# EasyEDA Pro project ProProject_Driver_STM32F405_2023-10-07.epro, schematic Schematic1_1

## Sheets
1 P1: Create Date: 2023-02-15; Page Name: P1; Project Name: Driver_STM32F405; Schematic Name: Schematic1_1; Update Date: 2023-04-14; Company: 嘉立创EDA; Page Size: A4; Version: V1.0
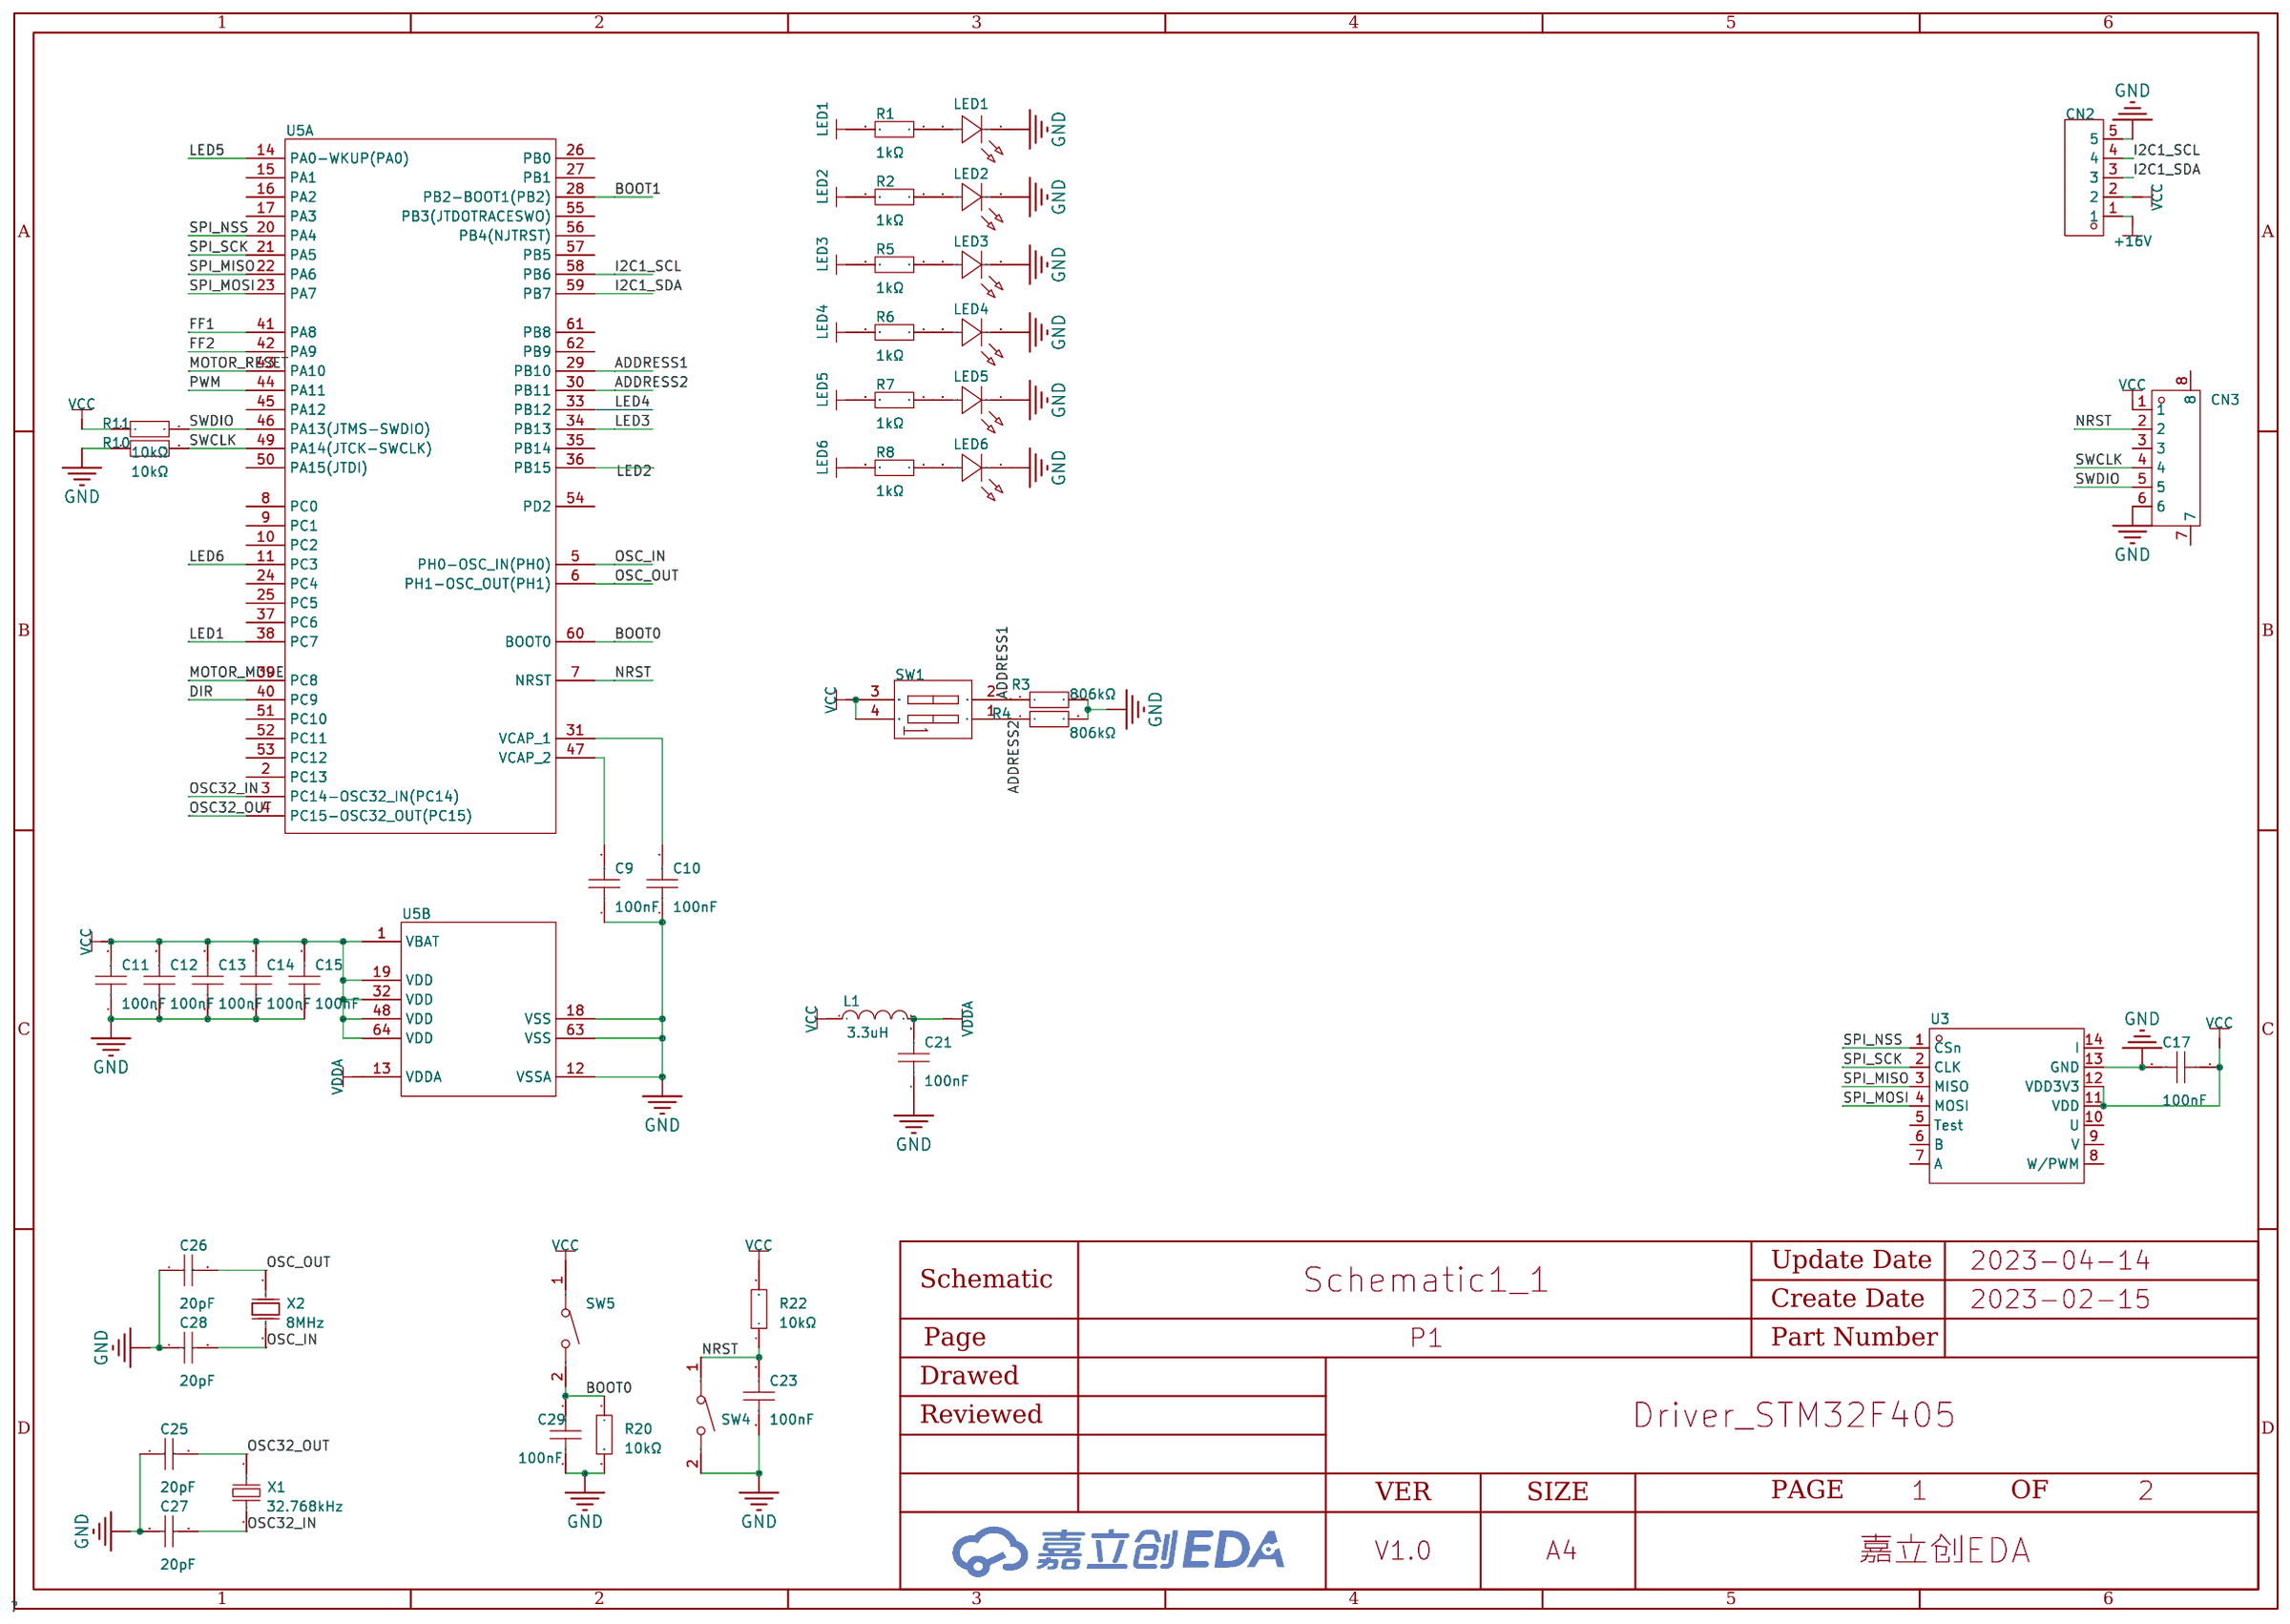
[diagram p2: P1]
2 P2: Create Date: 2023-04-06; Page Name: P2; Update Date: 2023-04-13
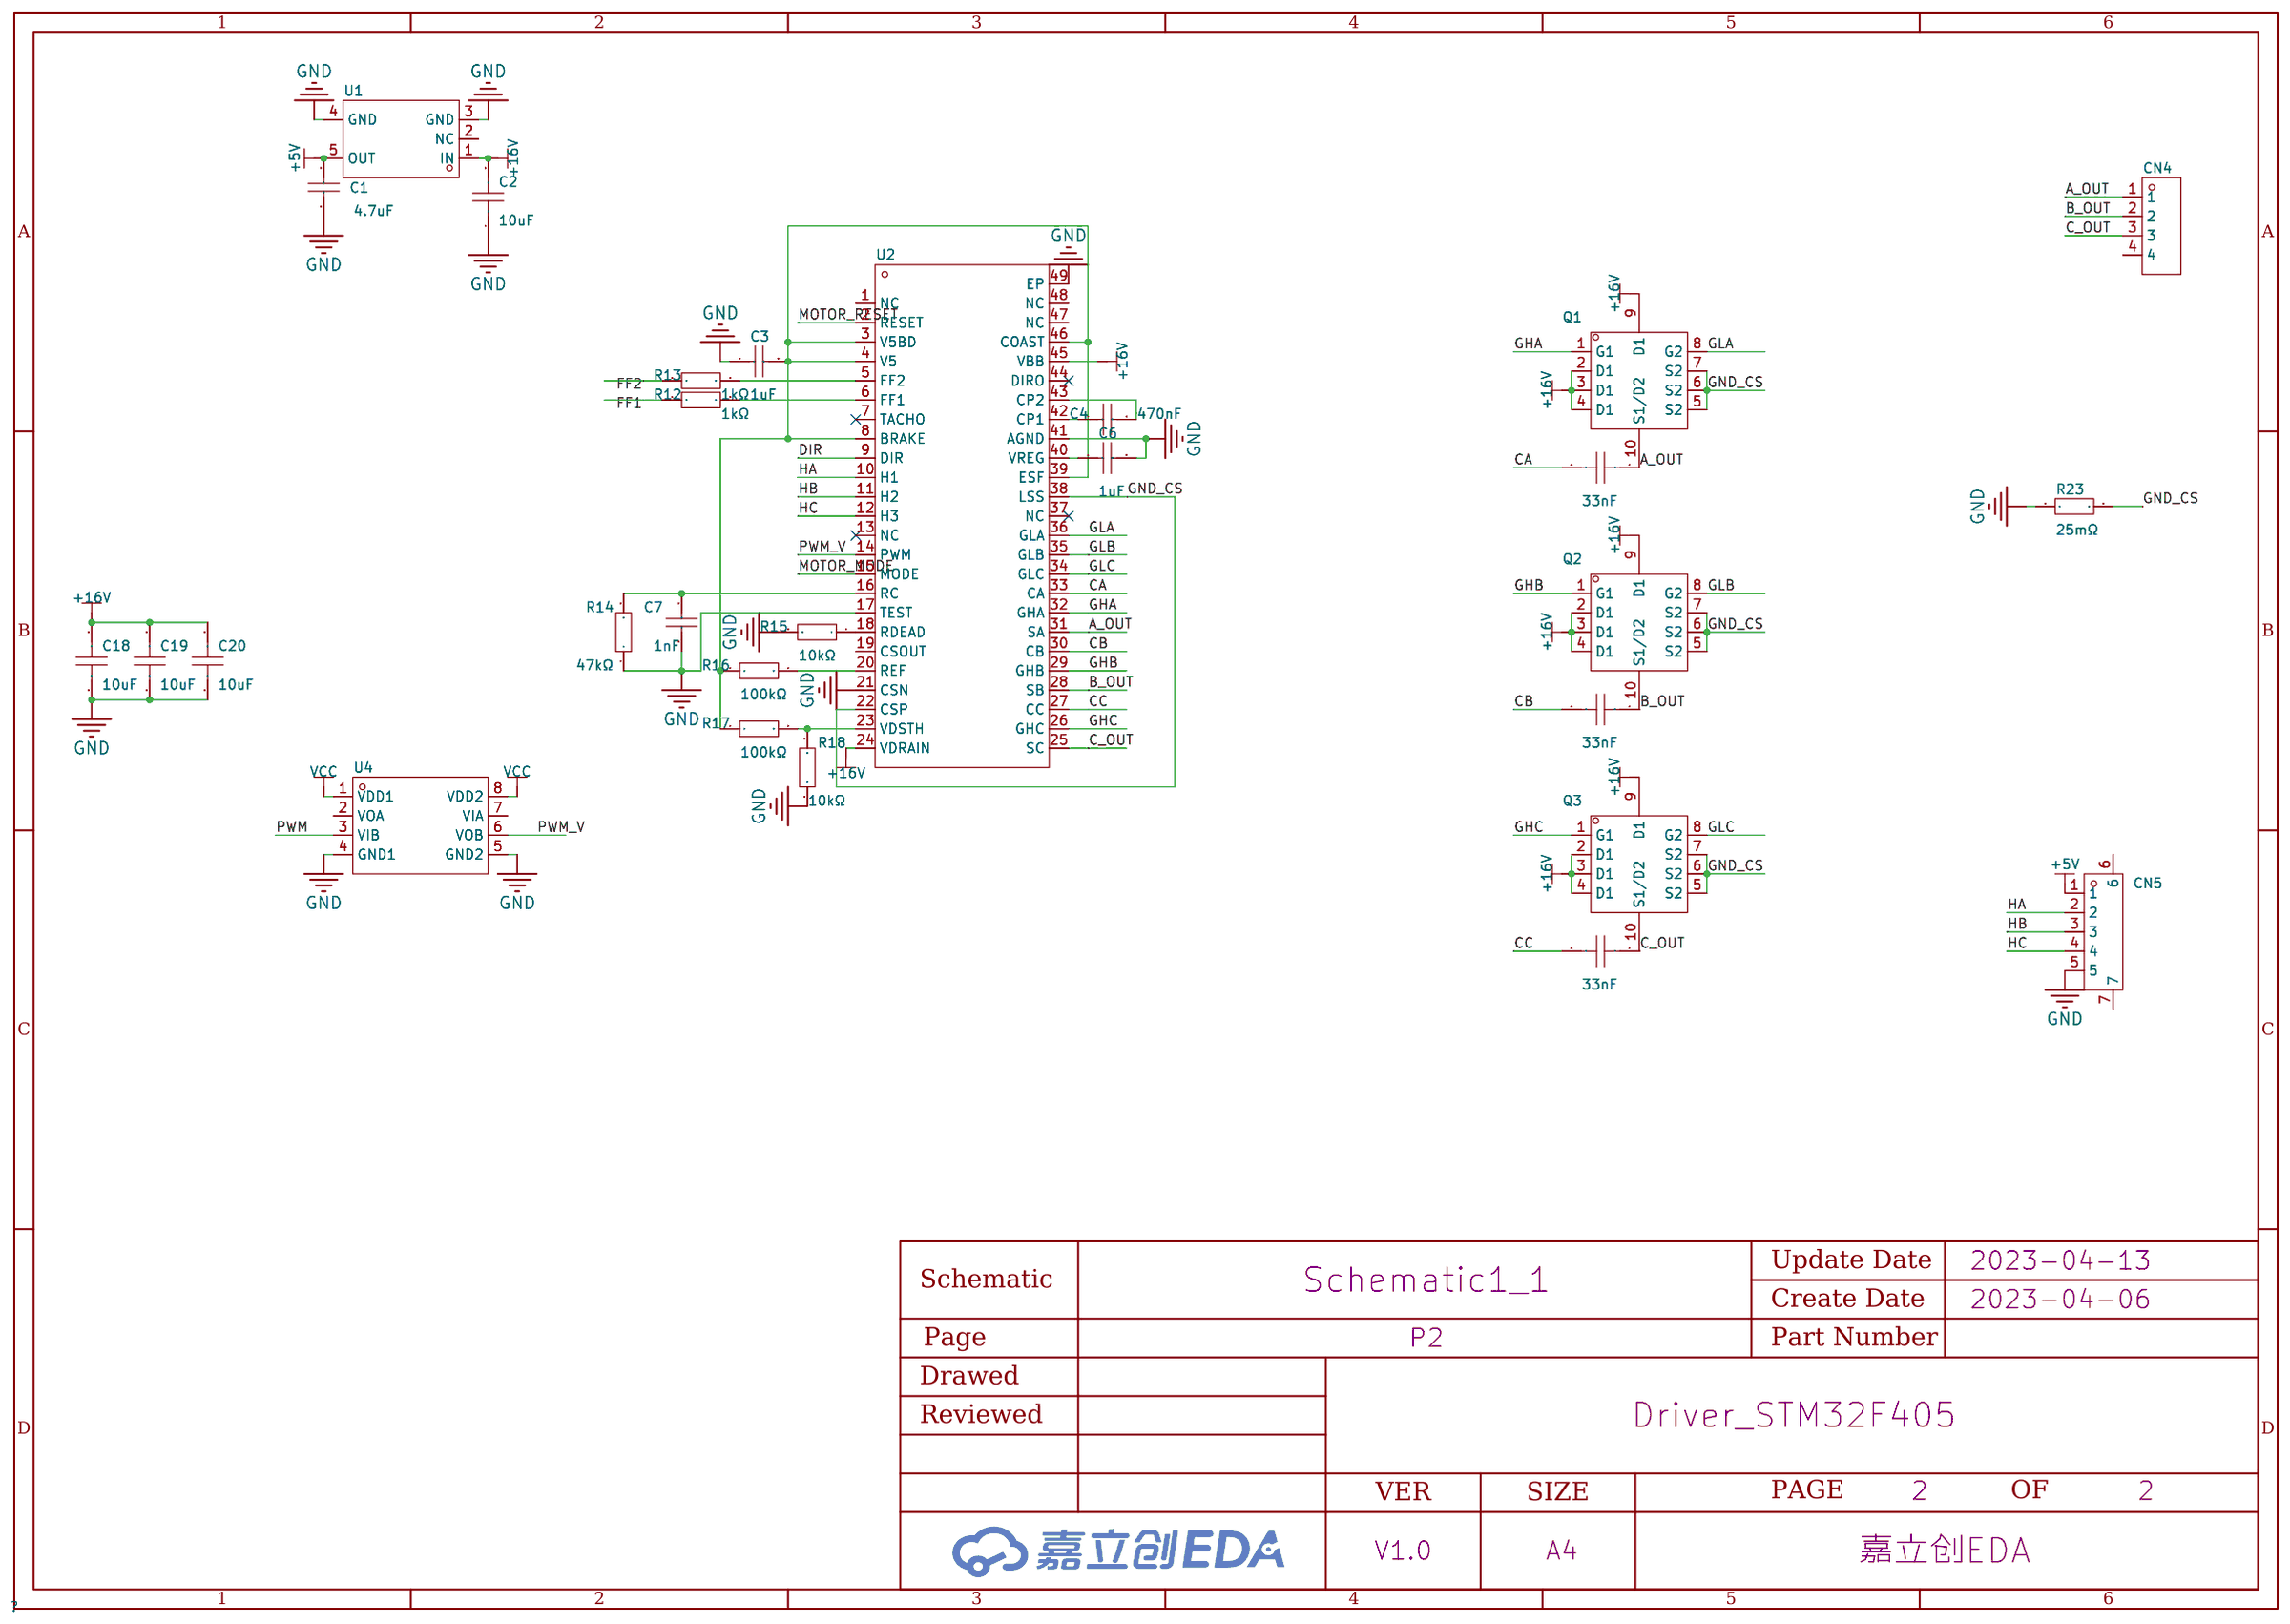
[diagram p3: P2]

## Parts
sheet P1
C9  100nF  [C0603]
C10  100nF  [C0603]
C11  100nF  [C0603]
C12  100nF  [C0603]
C13  100nF  [C0603]
C14  100nF  [C0603]
C15  100nF  [C0603]
C17  100nF  [C0603]
C21  100nF  [C0603]
C23  100nF  [C0603]
C25  20pF  [C0603]
C26  20pF  [C0603]
C27  20pF  [C0603]
C28  20pF  [C0603]
C29  100nF  [C0603]
CN2  5264-5AWD米色  [CONN-TH_5P-P2.50_5264-5AWD]
CN3  532610671  [CONN-SMD_6P-P1.25_53261-0671]
L1  3.3uH  [L0603]
LED1  XL-1608SURC-06  [LED0603-RD_RED]
LED2  XL-1608SYGC-06  [LED0603-RD_GREEN]
LED3  XL-1608SYGC-06  [LED0603-RD_GREEN]
LED4  XL-1608SYGC-06  [LED0603-RD_GREEN]
LED5  XL-1608UBC-04  [LED0603-RD_BLUE]
LED6  XL-1608UBC-04  [LED0603-RD_BLUE]
R1  1kΩ  [R0603]
R2  1kΩ  [R0603]
R3  806kΩ  [R0603]
R4  806kΩ  [R0603]
R5  1kΩ  [R0603]
R6  1kΩ  [R0603]
R7  1kΩ  [R0603]
R8  1kΩ  [R0603]
R10  10kΩ  [R0603]
R11  10kΩ  [R0603]
R20  10kΩ  [R0603]
R22  10kΩ  [R0603]
SW1  DSHP02TSGER  [SW-SMD_DSHP02TSGER]
SW4  TS-1088-AR02016  [SW-SMD_L3.9-W3.0-P4.45]
SW5  TS-1088-AR02016  [SW-SMD_L3.9-W3.0-P4.45]
U3  AS5047P-ATSM  [TSSOP-14_L5.0-W4.4-P0.65-LS6.4-BL]
U5  STM32F405RGT6  [LQFP-64_L10.0-W10.0-P0.50-LS12.0-BL]  (sections 1,2)
X1  32.768kHz  [FC-135R_L3.2-W1.5]
X2  8MHz  [CRYSTAL-SMD_L5.0-W3.2]
sheet P2
C1  4.7uF  [C0603]
C2  10uF  [C0603]
C3  1uF  [C0603]
C4  470nF  [C0603]
C5  33nF  [C0603]
C6  1uF  [C0603]
C7  1nF  [C0603]
C8  33nF  [C0603]
C16  33nF  [C0603]
C18  10uF  [C1206]
C19  10uF  [C1206]
C20  10uF  [C1206]
CN4  X2011WR-04A-N0SN  [CONN-TH_X2011WR-04A-N0SN]
CN5  X1002WRS-05L-HF-LPSW  [CONN-SMD_X1002WRS-05L-HF-LPSN]
Q1  TDM3412  [DFN3X3E-8_L3.0-W3.0-P0.65-BL-EP2]
Q2  TDM3412  [DFN3X3E-8_L3.0-W3.0-P0.65-BL-EP2]
Q3  TDM3412  [DFN3X3E-8_L3.0-W3.0-P0.65-BL-EP2]
R12  1kΩ  [R0603]
R13  1kΩ  [R0603]
R14  47kΩ  [R0603]
R15  10kΩ  [R0603]
R16  100kΩ  [R0603]
R17  100kΩ  [R0603]
R18  10kΩ  [R0603]
R23  25mΩ  [R1206]
U1  TPS7B6950DBVR  [SOT-23-5_L3.0-W1.7-P0.95-LS2.8-BL]
U2  A3930KJPTR-T  [LQFP-48_L7.0-W7.0-P0.50-LS9.0-BL-EP]
U4  π122U31  [SOIC-8_L4.9-W3.9-P1.27-LS6.0-BL]

## Library data of the parts
C9-C15 C17 C21 C23 C29 = TCC0603X7R104K500CT: 容值:100nF;精度:±10%;额定电压:50V;材质(温度系数):X7R;; LCSC Part Name: 100nF ±10% 50V; Supplier Part: C282519; Manufacturer: CCTC(三环); Supplier Footprint: 0603; JLCPCB Part Class: Extended Part; Datasheet: https://atta.szlcsc.com/upload/public/pdf/source/20180917/C282519_8CE721FA29EE85BB321020B63D7877A0.pdf; Supplier: LCSC; Tolerance: ±10%; Voltage Rated: 50V; Temperature Coefficient: X7R
C25-C28 = CL10C200JB8NNNC: 容值:20pF;精度:±5%;额定电压:50V;材质(温度系数):C0G;; LCSC Part Name: 20pF ±5% 50V; Supplier Part: C1648; Manufacturer: SAMSUNG(三星); Supplier Footprint: 0603; JLCPCB Part Class: Basic Part; Datasheet: https://atta.szlcsc.com/upload/public/pdf/source/20160103/1457707686863.pdf; Supplier: LCSC; Tolerance: ±5%; Voltage Rated: 50V; Temperature Coefficient: C0G
CN2 = 5264-5AWD米色: 参考系列:-;间距:2.5mm;插针结构:1x5P;排数:1;每排PIN数:5;行距:-;安装方式:-;触头材质:磷青铜;; LCSC Part Name: 5264插座 1*5P 弯针 带定位; Supplier Part: C176652; Manufacturer: BOOMELE(博穆精密); Supplier Footprint: 插件,P=2.5mm; JLCPCB Part Class: Extended Part; Datasheet: https://atta.szlcsc.com/upload/public/pdf/source/20180125/C176652_15168701824541304803.pdf; Supplier: LCSC; Pitch: 2.5mm; Pins Structure: 1x5P; Number of Rows: 1; Number of PINs Per Row: 5; Contact Material: 磷青铜
CN3 = 532610671: 参考系列:-;间距:1.25mm;插针结构:1x6P;排数:1;每排PIN数:6;行距:-;安装方式:-;触头材质:青铜;; LCSC Part Name: 1.25mm 1x6P; Supplier Part: C99277; Manufacturer: MOLEX; JLCPCB Part Class: Extended Part; Datasheet: https://atta.szlcsc.com/upload/public/pdf/source/20180713/C99277_7A4A98FEF11A2209B5FFC17F14BF7E54.pdf; Supplier: LCSC; Pitch: 1.25mm; Pins Structure: 1x6P; Number of Rows: 1; Number of PINs Per Row: 6; Contact Material: 青铜
L1 = CMI160808U3R3KT: 额定电流:15mA;电感值:3.3uH;精度:±10%;饱和电流(Isat):-;直流电阻(DCR):1Ω;; LCSC Part Name: 3.3uH ±10% 15mA 1Ω; Supplier Part: C139209; Manufacturer: FH(风华); Supplier Footprint: 0603; JLCPCB Part Class: Extended Part; Datasheet: https://atta.szlcsc.com/upload/public/pdf/source/20180412/C139209_76E8EB9664C870BAE46EFE11DEB22A4C.pdf; Supplier: LCSC; Rated Current: 15mA; Tolerance: ±10%; DC Resistance (DCR): 1Ω
LED1 = XL-1608SURC-06: 发光颜色:红灯;透镜颜色:无色透明;主波长:617nm~621nm;峰值波长:623nm;色温:-;测试电流:25mA;功率:55mW;发光角度:120°;安装方式:正贴;工作温度:-30℃~+85℃;; LCSC Part Name: 红灯 617nm~621nm 正贴; Supplier Part: C965799; Manufacturer: XINGLIGHT(成兴光); Supplier Footprint: 0603; JLCPCB Part Class: Extended Part; Datasheet: https://atta.szlcsc.com/upload/public/pdf/source/20221102/D860AFDD1CDB02C5A8064103A32707E2.pdf; Supplier: LCSC; Emitted Color: 红灯; Lens Color: 无色透明; Dominant Wavelength: 617nm~621nm; Peak Wavelength: 623nm; Forward Current: 25mA; Power Dissipation: 55mW; Viewing Angle: 120°; Mounting Sytle: 正贴; Operating Temperature: -30℃~+85℃
LED2-LED4 = XL-1608SYGC-06: 发光颜色:普绿/黄绿;透镜颜色:无色透明;主波长:570nm~573nm;峰值波长:575nm;色温:2800K~3160K;测试电流:25mA;功率:55mW;发光角度:120°;安装方式:正贴;工作温度:-30℃~+85℃;; LCSC Part Name: 普绿/黄绿 570nm~573nm 2800K~3160K 正贴; Supplier Part: C965805; Manufacturer: XINGLIGHT(成兴光); Supplier Footprint: 0603; JLCPCB Part Class: Extended Part; Datasheet: https://atta.szlcsc.com/upload/public/pdf/source/20221102/F362183196D461585F90F08511E6DE2E.pdf; Supplier: LCSC; Emitted Color: 普绿/黄绿; Lens Color: 无色透明; Dominant Wavelength: 570nm~573nm; Peak Wavelength: 575nm; Color Temperature: 2800K~3160K; Forward Current: 25mA; Power Dissipation: 55mW; Viewing Angle: 120°; Mounting Sytle: 正贴; Operating Temperature: -30℃~+85℃
LED5 LED6 = XL-1608UBC-04: 发光颜色:蓝灯;透镜颜色:无色透明;主波长:460nm~469nm;峰值波长:475nm;色温:-;测试电流:25mA;功率:80mW;发光角度:120°;安装方式:正贴;工作温度:-30℃~+85℃;; LCSC Part Name: 蓝灯 460nm~469nm 正贴; Supplier Part: C965807; Manufacturer: XINGLIGHT(成兴光); Supplier Footprint: 0603; JLCPCB Part Class: Extended Part; Datasheet: https://atta.szlcsc.com/upload/public/pdf/source/20221102/D52C9F3BB075BE608C95388C1716C351.pdf; Supplier: LCSC; Emitted Color: 蓝灯; Lens Color: 无色透明; Dominant Wavelength: 460nm~469nm; Peak Wavelength: 475nm; Forward Current: 25mA; Power Dissipation: 80mW; Viewing Angle: 120°; Mounting Sytle: 正贴; Operating Temperature: -30℃~+85℃
R1 R2 R5-R8 R12 R13 = 0603WAF1001T5E: 电阻类型:厚膜电阻;阻值:1kΩ;精度:±1%;功率:100mW;温度系数:±100ppm/℃;最大工作电压:75V;工作温度范围:-55℃~+155℃;; LCSC Part Name: 1kΩ ±1% 100mW; Supplier Part: C21190; Manufacturer: UNI-ROYAL(厚声); Supplier Footprint: 0603; JLCPCB Part Class: Basic Part; Datasheet: https://atta.szlcsc.com/upload/public/pdf/source/20200306/C422600_1E6D84923E4A46A82E41ADD87F860B5C.pdf; Supplier: LCSC; Type: 厚膜电阻; Tolerance: ±1%; Power(Watts): 100mW; Temperature Coefficient: ±100ppm/℃; Overload Voltage (Max): 75V; Operating Temperature Range: -55℃~+155℃
R3 R4 = 0603WAF8063T5E: 精度:±1%;阻值:806kΩ;温度系数:±100ppm/℃;功率:1/10W;最大工作电压:75V;工作温度范围:-55℃~+155℃;; LCSC Part Name: 806KΩ ±1%; Supplier Part: C23250; Manufacturer: UNI-ROYAL(厚声); Supplier Footprint: 0603; JLCPCB Part Class: Extended Part; Datasheet: https://atta.szlcsc.com/upload/public/pdf/source/20170920/C23250_1505901154958982629.pdf; Supplier: LCSC; Tolerance: ±1%; Temperature Coefficient: ±100ppm/℃; Power(Watts): 1/10W; Overload Voltage (Max): 75V; Operating Temperature Range: -55℃~+155℃
R10 R11 R15 R18 R20 R22 = RC0603FR-0710KL: 电阻类型:厚膜电阻;阻值:10kΩ;精度:±1%;功率:100mW;温度系数:±100ppm/℃;最大工作电压:75V;工作温度范围:-55℃~+155℃;; LCSC Part Name: 10kΩ ±1% 100mW; Supplier Part: C98220; Manufacturer: YAGEO(国巨); Supplier Footprint: 0603; JLCPCB Part Class: Extended Part; Datasheet: https://atta.szlcsc.com/upload/public/pdf/source/20170522/1495423494387.pdf; Supplier: LCSC; Type: 厚膜电阻; Tolerance: ±1%; Power(Watts): 100mW; Temperature Coefficient: ±100ppm/℃; Overload Voltage (Max): 75V; Operating Temperature Range: -55℃~+155℃
SW1 = DSHP02TSGER: 类型:平拨，凹槽式;电路结构:单刀单掷;开关位数:2;引脚间距:1.27mm;颜色:黑色;; LCSC Part Name: 2位 1.27间距; Supplier Part: C367376; Manufacturer: YE; Supplier Footprint: SMD-4P,4.1x5.4mm; JLCPCB Part Class: Extended Part; Datasheet: https://atta.szlcsc.com/upload/public/pdf/source/20190604/C367376_CB5658EC78844F4C2243AD86B8AB208E.pdf; Supplier: LCSC; Type: 平拨，凹槽式; Circuit: 单刀单掷; Number of Positions: 2; Lead Pitch: 1.27mm; Color: 黑色
SW4 SW5 = TS-1088-AR02016: 触点电流:50mA;额定电压(DC):12V;绝缘电阻:100MΩ;电路结构:单刀单掷;安装方式:立贴;按钮形状:圆形按钮;按钮/盖帽颜色:黑色;作用力:160gf@±50gf;机械寿命:100000;工作温度:-30℃~+80℃;引脚样式:SMD接片;开关长度:4mm;开关宽度:3mm;开关高度:2mm;带支架:否;; LCSC Part Name: 3x4x2.0 160gf 贴片无柱轻触开关; Supplier Part: C720477; Manufacturer: XUNPU(讯普); Supplier Footprint: SMD; JLCPCB Part Class: Extended Part; Datasheet: https://atta.szlcsc.com/upload/public/pdf/source/20200810/C720475_60D09DD6C54279ADDB2DC25100F1CC11.pdf; Supplier: LCSC; Contact Current: 50mA; Voltage Rating (DC): 12V; Insulation Resistance: 100MΩ; Circuit: 单刀单掷; Mounting Style: 立贴; Actuator Style: 圆形按钮; Actuator/Cap Color: 黑色; Operating Force: 160gf@±50gf; Mechanical Life: 100000; Operating Temperature: -30℃~+80℃; Pin Style: SMD接片; Switch Length: 4mm; Switch Width: 3mm; Switch Height: 2mm; Strike Gundam: 否
U3 = AS5047P-ATSM: Supplier Part: C141793; Supplier Footprint: TSSOP-14; JLCPCB Part Class: Extended Part; Datasheet: https://atta.szlcsc.comnull; Supplier: LCSC
U5 = STM32F405RGT6: CPU内核:ARM Cortex-M4;CPU最大主频:168MHz;工作电压范围:1.8V~3.6V;内部振荡器:有;程序 FLASH容量:1MB;RAM总容量:192KB;EEPROM/数据 FLASH容量:-;GPIO端口数量:51;ADC(单元数/通道数/位数):1@x16ch/12bit;DAC(单元数/通道数/位数):1@x2ch/12bit;外设/功能/协议栈:欠压检测/复位；DMA；LCD驱动；看门狗；POR；PWM;工作温度范围:-40℃~+85℃;; LCSC Part Name: ARM Cortex-M4 168MHz 闪存：1MB RAM：192KB; Supplier Part: C15742; Manufacturer: ST(意法半导体); Supplier Footprint: LQFP-64(10x10); JLCPCB Part Class: Extended Part; Datasheet: https://atta.szlcsc.com/upload/public/pdf/source/20140724/1457707160365.pdf; Supplier: LCSC; CPU Core: ARM Cortex-M4; Maximum Frequency: 168MHz; Supply Voltage Range: 1.8V~3.6V; Internal Oscillator: 有; Program FLASH Size: 1MB; RAM Size: 192KB; GPIO Ports Number: 51; ADC (Units/Channels/bits): 1@x16ch/12bit; DAC (Units/Channels/bits): 1@x2ch/12bit; Peripherals / Functions / Protocol Stacks: 欠压检测/复位；DMA；LCD驱动；看门狗；POR；PWM; Operating Temperature Range: -40℃~+85℃
X1 = Q13FC1350000400: 晶振类型:贴片无源晶振;频率:32.768kHz;频率公差:±20ppm;负载电容:12.5pF;等效串联电阻(ESR):70kΩ;工作温度:-40℃~+85℃;; LCSC Part Name: 32.768kHz ±20ppm 12.5pF; Supplier Part: C32346; Manufacturer: EPSON(爱普生); Supplier Footprint: SMD3215-2P; JLCPCB Part Class: Basic Part; Datasheet: https://atta.szlcsc.com/upload/public/pdf/source/20190108/C32346_746D6B07EAF90824457A96480007685F.pdf; Supplier: LCSC; Crystal Type: 贴片无源晶振; Frequency Tolerance: ±20ppm; Load Capacitance: 12.5pF; Equivalent Series Resistance (ESR): 70kΩ; Operating Temperature: -40℃~+85℃
X2 = X50328MSB2GI: 晶振类型:贴片无源晶振;频率:8MHz;频率公差:±10ppm;频率稳定度:±50ppm;负载电容:20pF;工作温度:-40℃~+85℃;; LCSC Part Name: YSX530GA 8MHz ±10ppm 20pF; Supplier Part: C115962; Manufacturer: YXC(扬兴晶振); Supplier Footprint: SMD5032-2P; JLCPCB Part Class: Basic Part; Datasheet: https://atta.szlcsc.com/upload/public/pdf/source/20210329/C112559_847D3CACBA33ACCEB57DEA3AEBB187A1.pdf; Supplier: LCSC; Crystal Type: 贴片无源晶振; Frequency Tolerance: ±10ppm; Frequency Stability: ±50ppm; Load Capacitance: 20pF; Operating Temperature: -40℃~+85℃
C1 = CL10A475KO8NNNC: 温度系数:X5R;精度:±10%;容值:4.7uF;额定电压:16V;; LCSC Part Name: 4.7uF ±10% 16V; Supplier Part: C19666; Manufacturer: SAMSUNG(三星); Supplier Footprint: 0603; JLCPCB Part Class: Basic Part; Datasheet: https://atta.szlcsc.com/upload/public/pdf/source/20160103/1457707703134.pdf; Supplier: LCSC; Temperature Coefficient: X5R; Tolerance: ±10%; Voltage Rated: 16V
C2 = GRM188C80G106KE47D: 容值:10uF;精度:±10%;额定电压:-;材质(温度系数):-;; LCSC Part Name: 10uF ±10%; Supplier Part: C710916; Manufacturer: muRata(村田); Supplier Footprint: 0603; JLCPCB Part Class: Extended Part; Datasheet: https://atta.szlcsc.com/upload/public/pdf/source/20210205/C710916_8901BCC8D8E6CC54F2C999D22152DEF1.pdf; Supplier: LCSC; Tolerance: ±10%
C3 C6 = CL10A105KB8NNNC: 容值:1uF;精度:±10%;额定电压:50V;材质(温度系数):X5R;; LCSC Part Name: 1uF ±10% 50V; Supplier Part: C15849; Manufacturer: SAMSUNG(三星); Supplier Footprint: 0603; JLCPCB Part Class: Basic Part; Datasheet: https://atta.szlcsc.com/upload/public/pdf/source/20160103/1457707679084.pdf; Supplier: LCSC; Tolerance: ±10%; Voltage Rated: 50V; Temperature Coefficient: X5R
C4 = 0603B474K500NT: 容值:470nF;精度:±10%;额定电压:50V;材质(温度系数):X7R;; LCSC Part Name: 470nF ±10% 50V; Supplier Part: C77572; Manufacturer: FH(风华); Supplier Footprint: 0603; JLCPCB Part Class: Extended Part; Datasheet: https://atta.szlcsc.com/upload/public/pdf/source/20170923/C77572_1506149543326988941.pdf; Supplier: LCSC; Tolerance: ±10%; Voltage Rated: 50V; Temperature Coefficient: X7R
C5 C8 C16 = CL10B333JB8NNNC: 容值:33nF;精度:±5%;额定电压:50V;材质(温度系数):X7R;; LCSC Part Name: 33nF ±5% 50V; Supplier Part: C377760; Manufacturer: SAMSUNG(三星); Supplier Footprint: 0603; JLCPCB Part Class: Extended Part; Datasheet: https://atta.szlcsc.com/upload/public/pdf/source/20190322/C377760_4801615B1239BA7CCDCF452430F04471.pdf; Supplier: LCSC; Tolerance: ±5%; Voltage Rated: 50V; Temperature Coefficient: X7R
C7 = CL10B102KB8NNNC: 容值:1nF;精度:±10%;额定电压:50V;材质(温度系数):X7R;; LCSC Part Name: 1nF ±10% 50V; Supplier Part: C1588; Manufacturer: SAMSUNG(三星); Supplier Footprint: 0603; JLCPCB Part Class: Basic Part; Datasheet: https://atta.szlcsc.com/upload/public/pdf/source/20160103/1457707679526.pdf; Supplier: LCSC; Tolerance: ±10%; Voltage Rated: 50V; Temperature Coefficient: X7R
C18-C20 = GRM31CB31H106KA12L: 容值:10uF;精度:±10%;额定电压:50V;材质(温度系数):B;; LCSC Part Name: 10uF ±10% 50V; Supplier Part: C521234; Manufacturer: muRata(村田); Supplier Footprint: 1206; JLCPCB Part Class: Extended Part; Datasheet: https://atta.szlcsc.com/upload/public/pdf/source/20200424/C521234_36A2086CC2FC59561FA20FEB9FAD436A.pdf; Supplier: LCSC; Tolerance: ±10%; Voltage Rated: 50V; Temperature Coefficient: B
CN4 = X2011WR-04A-N0SN: 参考系列:PH;间距:2mm;插针结构:1x4P;排数:1;每排PIN数:4;行距:-;公母:母型插口;安装方式:弯插;额定电流:2A;触头材质:黄铜;触头镀层:锡;工作温度范围:-25℃~+85℃;焊接温度(最大值):260℃;; LCSC Part Name: PH 2mm 1x4P 弯插; Supplier Part: C571313; Manufacturer: XKB Connectivity(中国星坤); Supplier Footprint: 弯插,P=2mm; JLCPCB Part Class: Extended Part; Datasheet: https://atta.szlcsc.com/upload/public/pdf/source/20211011/CF83BFD58356D8225E54D606CB4957E3.pdf; Supplier: LCSC; Reference Series: PH; Pitch: 2mm; Pins Structure: 1x4P; Number of Rows: 1; Number of PINs Per Row: 4; Gender: 母型插口; Mounting Style: 弯插; Current Rating (Max): 2A; Contact Material: 黄铜; Contact Plating: 锡; Operating Temperature Range: -25℃~+85℃; Welding Temperature (Max): 260℃
CN5 = X1002WRS-05L-HF-LPSW_C400342: 参考系列:-;间距:1mm;插针结构:1x5P;排数:1;每排PIN数:5;行距:-;公母:母型插口;安装方式:卧贴;额定电流:1A;触头材质:黄铜;触头镀层:锡;工作温度范围:-25℃~+85℃;焊接温度(最大值):260℃;; LCSC Part Name: 1mm 1x5P 卧贴 带锁扣; Supplier Part: C400342; Manufacturer: XKB Connectivity(中国星坤); Supplier Footprint: SMD,P=1mm; JLCPCB Part Class: Extended Part; Datasheet: https://atta.szlcsc.com/upload/public/pdf/source/20200618/C400342_A8A615FC54EF521CBEBC311105538FC8.pdf; Supplier: LCSC; Pitch: 1mm; Pins Structure: 1x5P; Number of Rows: 1; Number of PINs Per Row: 5; Gender: 母型插口; Mounting Style: 卧贴; Current Rating (Max): 1A; Contact Material: 黄铜; Contact Plating: 锡; Operating Temperature Range: -25℃~+85℃; Welding Temperature (Max): 260℃
Q1-Q3 = TDM3412: 类型:双N沟道(半桥);漏源电压(Vdss):30V;连续漏极电流(Id):18A;功率(Pd):20W;导通电阻(RDS(on)@Vgs,Id):10.8mΩ@10V,10A;阈值电压(Vgs(th)@Id):2.5V@250uA;; LCSC Part Name: 双N沟道(半桥) 30V 18A; Supplier Part: C179164; Manufacturer: Techcode(泰德); Supplier Footprint: DFN-E-8(3x3); JLCPCB Part Class: Extended Part; Datasheet: https://atta.szlcsc.com/upload/public/pdf/source/20180716/C179164_F7404319F6953C2907F859AC13FDFF65.pdf; Supplier: LCSC; Type: 双N沟道(半桥); Drain Source Voltage (Vdss): 30V; Continuous Drain Current (Id): 18A; Power Dissipation (Pd): 20W; Drain Source On Resistance (RDS(on)@Vgs,Id): 10.8mΩ@10V,10A; Gate Threshold Voltage (Vgs(th)@Id): 2.5V@250uA
R14 = 0603WAF4702T5E: 精度:±1%;温度系数:±100ppm/℃;功率:1/10W;阻值:47kΩ;最大工作电压:75V;工作温度范围:-55℃~+155℃;; LCSC Part Name: 47KΩ ±1%; Supplier Part: C25819; Manufacturer: UNI-ROYAL(厚声); Supplier Footprint: 0603; JLCPCB Part Class: Basic Part; Datasheet: https://atta.szlcsc.com/upload/public/pdf/source/20170920/C25819_1505901557326983389.pdf; Supplier: LCSC; Tolerance: ±1%; Temperature Coefficient: ±100ppm/℃; Power(Watts): 1/10W; Overload Voltage (Max): 75V; Operating Temperature Range: -55℃~+155℃
R16 R17 = 0603WAF1003T5E: 电阻类型:厚膜电阻;阻值:100kΩ;精度:±1%;功率:100mW;温度系数:±100ppm/℃;最大工作电压:75V;工作温度范围:-55℃~+155℃;; LCSC Part Name: 100kΩ ±1% 100mW; Supplier Part: C25803; Manufacturer: UNI-ROYAL(厚声); Supplier Footprint: 0603; JLCPCB Part Class: Basic Part; Datasheet: https://atta.szlcsc.com/upload/public/pdf/source/20200306/C422600_1E6D84923E4A46A82E41ADD87F860B5C.pdf; Supplier: LCSC; Type: 厚膜电阻; Tolerance: ±1%; Power(Watts): 100mW; Temperature Coefficient: ±100ppm/℃; Overload Voltage (Max): 75V; Operating Temperature Range: -55℃~+155℃
R23 = RLM12FTCMR025: 阻值:25mΩ;精度:±1%;功率:1W;; LCSC Part Name: 25mΩ ±1% 1W; Supplier Part: C316226; Manufacturer: 大毅科技; Supplier Footprint: 1206; JLCPCB Part Class: Extended Part; Datasheet: https://atta.szlcsc.com/upload/public/pdf/source/20181023/C316226_D363EC3D88B44FBEE1B74F4A1DF43EB9.pdf; Supplier: LCSC; Tolerance: ±1%; Power(Watts): 1W; Temperature Coefficient: ±75ppm/℃
U1 = TPS7B6950DBVR: 输出类型:固定;输出极性:正;输出通道数:1;最大输入电压:40V;输出电压:5V;压差:800mV@(100mA);输出电流:150mA;电源纹波抑制比(PSRR):60dB@(100Hz);; LCSC Part Name: 正 Vin=40V Vout=5V 150mA 60dB@(100Hz); Supplier Part: C174327; Manufacturer: TI(德州仪器); Supplier Footprint: SOT-23-5; JLCPCB Part Class: Extended Part; Datasheet: https://atta.szlcsc.com/upload/public/pdf/source/20180202/C174327_15175649229381336371.pdf; Supplier: LCSC; Output Type: 固定; Output Polarity: 正; Number of Outputs: 1; Maximum Input Voltage: 40V; Output Voltage: 5V; Dropout Voltage: 800mV@(100mA); Output Current: 150mA; Power Supply Rejection Ratio (PSRR): 60dB@(100Hz)
U2 = A3930KJPTR-T: 电源电压:5.5V~50V;输出电流:-;接口:并行;; LCSC Part Name: 电机驱动芯片; Supplier Part: C459252; Manufacturer: ALLEGRO(美国埃戈罗); Supplier Footprint: LQFP-48(7x7); JLCPCB Part Class: Extended Part; Datasheet: https://atta.szlcsc.com/upload/public/pdf/source/20200518/C459252_E214869B5841466FF326F30C716B8FBE.pdf; Supplier: LCSC; Type: 无刷直流BLDC; Supply Voltage: 5.5V~50V; Interface: 并行; Operating Temperature: -40℃~+150℃@(Ta)
U4 = π122U31: 隔离器的技术构架:-;类型:-;通道类型:-;隔离电压:-;数据速率:-;通道数:-;; Supplier Part: C471590; Manufacturer: 2Pai Semi(荣湃); Supplier Footprint: SOIC_N-8; JLCPCB Part Class: Extended Part; Datasheet: https://atta.szlcsc.com/upload/public/pdf/source/20191223/C471590_0EC0A3D8C50EA147F11BC2F4781C203C.pdf; Supplier: LCSC

## Nets
+5V: C1.2 CN5.1 U1.5(OUT)
+16V: C2.2 C18.2 C19.2 C20.2 CN2.1 Q1.2(D1) Q1.3(D1) Q1.4(D1) Q1.9(D1) Q2.2(D1) Q2.3(D1) Q2.4(D1) Q2.9(D1) Q3.2(D1) Q3.3(D1) Q3.4(D1) Q3.9(D1) U1.1(IN) U2.24(VDRAIN) U2.45(VBB)
GND: C1.1 C2.1 C3.1 C6.2 C7.1 C9.1 C10.1 C11.1 C12.1 C13.1 C14.1 C15.1 C17.2 C18.1 C19.1 C20.1 C21.1 C23.1 C25.1 C26.1 C27.1 C28.1 C29.2 CN2.5 CN3.6 CN5.5 LED1.1(K) LED2.1(K) LED3.1(K) LED4.1(K) LED5.1(K) LED6.1(K) R3.2 R4.2 R10.1 R14.1 R15.2 R18.1 R20.2 R23.1 SW4.2 U1.3(GND) U1.4(GND) U2.17(TEST) U2.21(CSN) U2.41(AGND) U2.49(EP) U3.13(GND) U4.4(GND1) U4.5(GND2) U5.12(VSSA) U5.18(VSS) U5.63(VSS)
GND_CS: Q1.5(S2) Q1.6(S2) Q1.7(S2) Q2.5(S2) Q2.6(S2) Q2.7(S2) Q3.5(S2) Q3.6(S2) Q3.7(S2) R23.2 U2.22(CSP) U2.38(LSS)
VCC: C11.2 C12.2 C13.2 C14.2 C15.2 C17.1 CN2.2 CN3.1 L1.1 R11.1 R22.2 SW1.3(B2) SW1.4(B1) SW5.1 U3.11(VDD) U3.12(VDD3V3) U4.1(VDD1) U4.8(VDD2) U5.1(VBAT) U5.19(VDD) U5.32(VDD) U5.48(VDD) U5.64(VDD)
VDDA: C21.2 L1.2 U5.13(VDDA)
A_OUT: C5.1 CN4.1 Q1.10(S1/D2) U2.31(SA)
ADDRESS1: R3.1 SW1.2(A2) U5.29(PB10)
ADDRESS2: R4.1 SW1.1(A1) U5.30(PB11)
B_OUT: C8.1 CN4.2 Q2.10(S1/D2) U2.28(SB)
BOOT0: C29.1 R20.1 SW5.2 U5.60(BOOT0)
BOOT1: U5.28(PB2-BOOT1(PB2))
C_OUT: C16.1 CN4.3 Q3.10(S1/D2) U2.25(SC)
CA: C5.2 U2.33(CA)
CB: C8.2 U2.30(CB)
CC: C16.2 U2.27(CC)
DIR: U2.9(DIR) U5.40(PC9)
FF1: R12.1 U5.41(PA8)
FF2: R13.1 U5.42(PA9)
GHA: Q1.1(G1) U2.32(GHA)
GHB: Q2.1(G1) U2.29(GHB)
GHC: Q3.1(G1) U2.26(GHC)
GLA: Q1.8(G2) U2.36(GLA)
GLB: Q2.8(G2) U2.35(GLB)
GLC: Q3.8(G2) U2.34(GLC)
HA: CN5.2 U2.10(H1)
HB: CN5.3 U2.11(H2)
HC: CN5.4 U2.12(H3)
I2C1_SCL: CN2.4 U5.58(PB6)
I2C1_SDA: CN2.3 U5.59(PB7)
LED1: R1.2 U5.38(PC7)
LED2: R2.2 U5.36(PB15)
LED3: R5.2 U5.34(PB13)
LED4: R6.2 U5.33(PB12)
LED5: R7.2 U5.14(PA0-WKUP(PA0))
LED6: R8.2 U5.11(PC3)
MOTOR_MODE: U2.15(MODE) U5.39(PC8)
MOTOR_RESET: U2.2(RESET) U5.43(PA10)
NRST: C23.2 CN3.2 R22.1 SW4.1 U5.7(NRST)
OSC32_IN: C27.2 U5.3(PC14-OSC32_IN(PC14)) X1.2
OSC32_OUT: C25.2 U5.4(PC15-OSC32_OUT(PC15)) X1.1
OSC_IN: C28.2 U5.5(PH0-OSC_IN(PH0)) X2.2(OSC2)
OSC_OUT: C26.2 U5.6(PH1-OSC_OUT(PH1)) X2.1(OSC1)
PWM: U4.3(VIB) U5.44(PA11)
PWM_V: U2.14(PWM) U4.6(VOB)
SPI_MISO: U3.3(MISO) U5.22(PA6)
SPI_MOSI: U3.4(MOSI) U5.23(PA7)
SPI_NSS: U3.1(CSn) U5.20(PA4)
SPI_SCK: U3.2(CLK) U5.21(PA5)
SWCLK: CN3.4 R10.2 U5.49(PA14(JTCK-SWCLK))
SWDIO: CN3.5 R11.2 U5.46(PA13(JTMS-SWDIO))
$1N4505: C9.2 U5.47(VCAP_2)
$1N4511: C10.2 U5.31(VCAP_1)
$1N104760: LED6.2(A) R8.1
$1N104762: LED5.2(A) R7.1
$1N104764: LED1.2(A) R1.1
$1N104766: LED2.2(A) R2.1
$1N104768: LED3.2(A) R5.1
$1N104770: LED4.2(A) R6.1
$2N2664: R13.2 U2.5(FF2)
$2N2665: R12.2 U2.6(FF1)
$2N2672: C4.2 U2.43(CP2)
$2N2678: C6.1 U2.40(VREG)
$2N2679: C4.1 U2.42(CP1)
$2N2680: R16.2 U2.20(REF)
$2N2681: C7.2 R14.2 U2.16(RC)
$2N2682: R17.2 R18.2 U2.23(VDSTH)
$2N2684: R15.1 U2.18(RDEAD)
$2N2699: C3.2 R16.1 R17.1 U2.3(V5BD) U2.4(V5) U2.8(BRAKE) U2.39(ESF) U2.46(COAST)

Not connected (* = marked no-connect by the designer): CN3 3 7 8; CN4 4; CN5 6 7; U1 2(NC); U2 1(NC) 7(TACHO)* 13(NC)* 19(CSOUT) 37(NC)* 44(DIRO)* 47(NC) 48(NC); U3 5(Test) 6(B) 7(A) 8(W/PWM) 9(V) 10(U) 14(I); U4 2(VOA) 7(VIA); U5 2(PC13) 8(PC0) 9(PC1) 10(PC2) 15(PA1) 16(PA2) 17(PA3) 24(PC4) 25(PC5) 26(PB0) 27(PB1) 35(PB14) 37(PC6) 45(PA12) 50(PA15(JTDI)) 51(PC10) 52(PC11) 53(PC12) 54(PD2) 55(PB3(JTDOTRACESWO)) 56(PB4(NJTRST)) 57(PB5) 61(PB8) 62(PB9)
